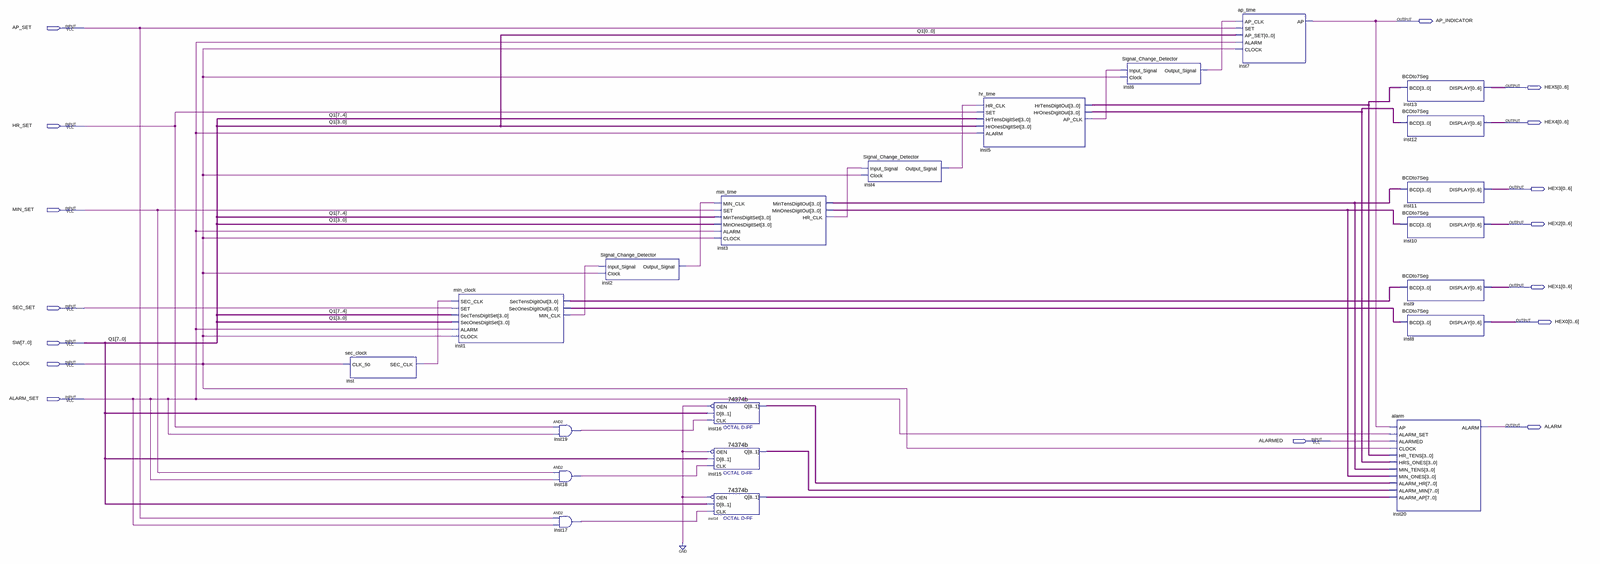
[diagram p0: schematic sheet, whole]
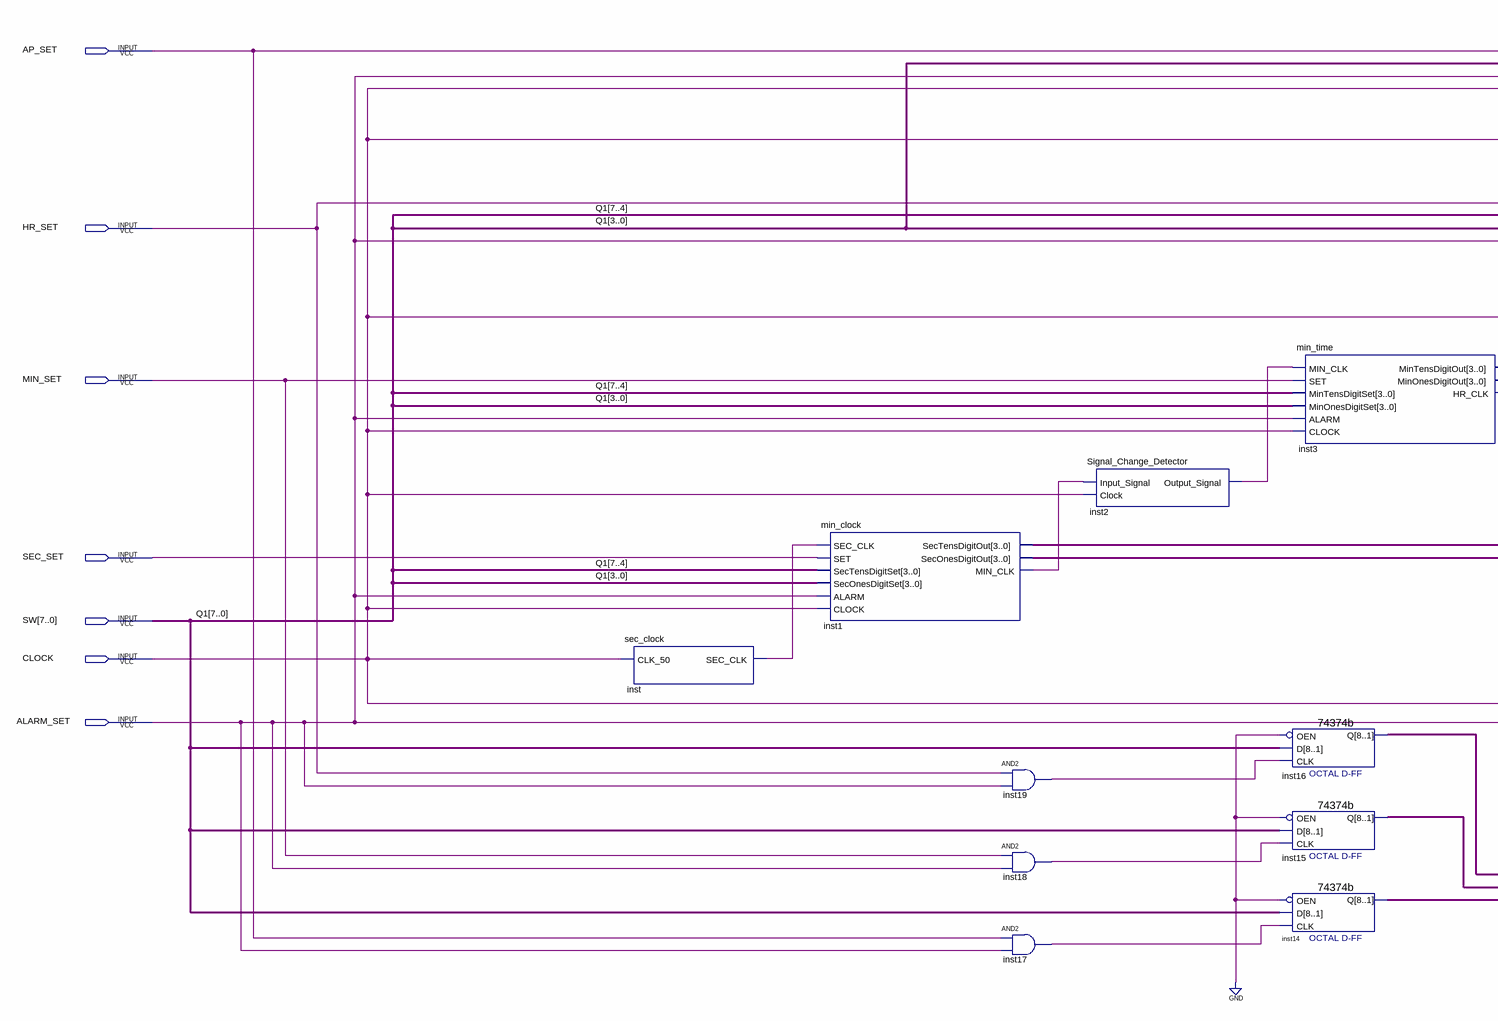
[diagram p1: schematic sheet, left part]
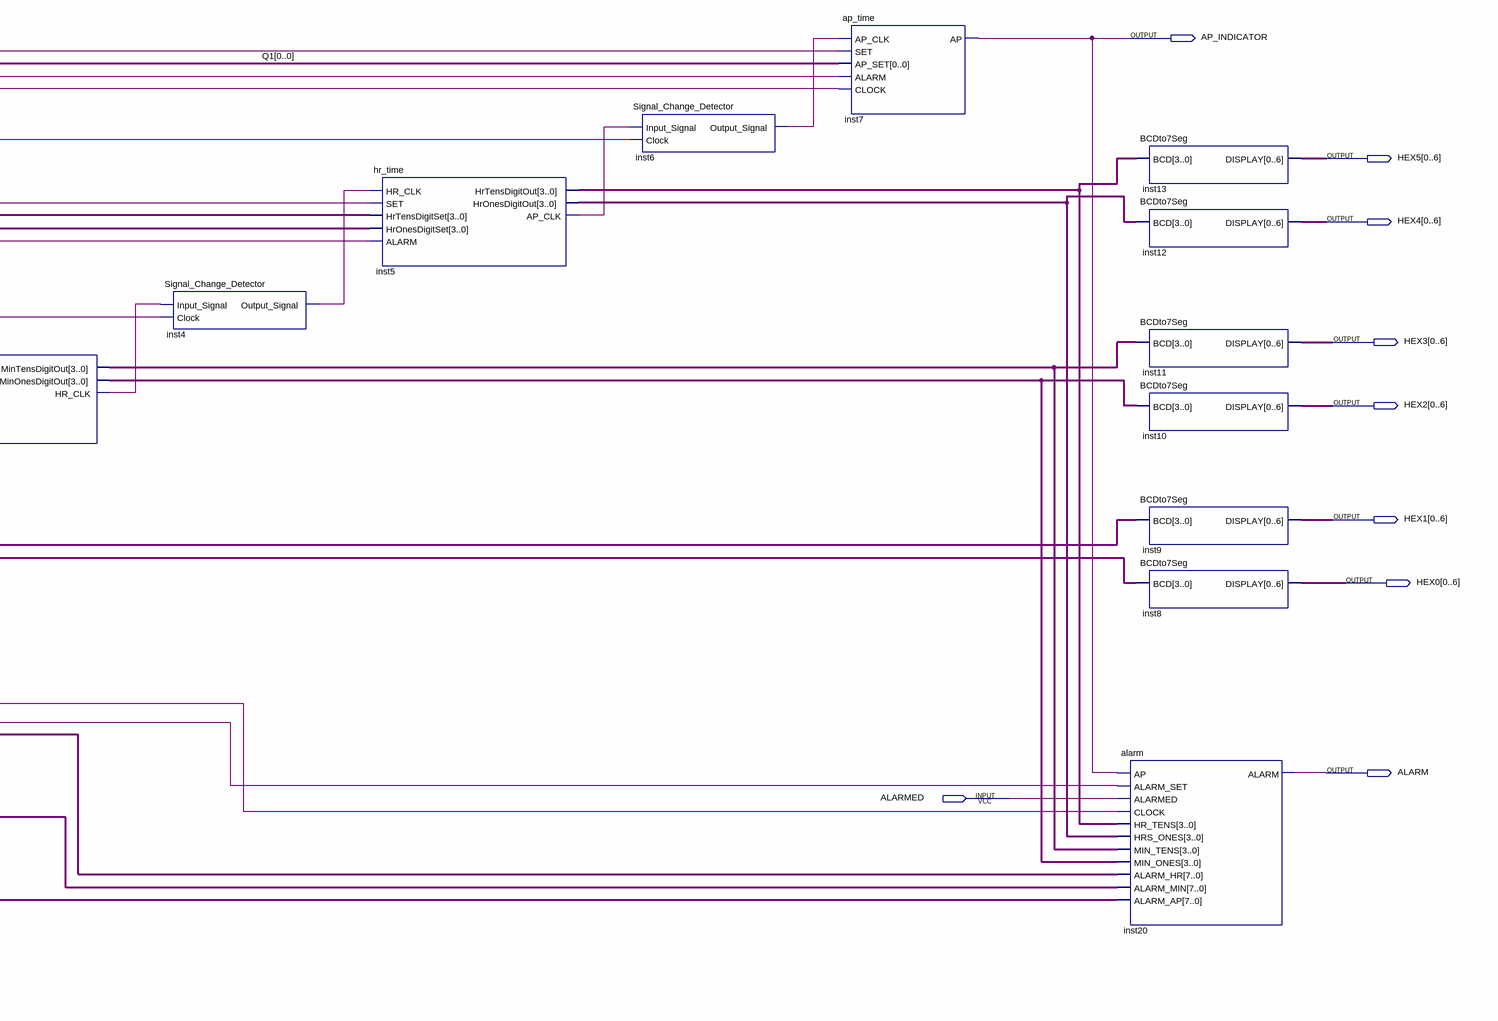
[diagram p2: schematic sheet, right part]
// Quartus schematic lab3_1.bdf as structural Verilog: 21 symbols, 16 pins
module lab3_1 (
  input  AP_SET,
  input  HR_SET,
  input  MIN_SET,
  input  SEC_SET,
  input  [7:0] SW,
  input  CLOCK,
  input  ALARM_SET,
  input  ALARMED,
  output AP_INDICATOR,
  output [0:6] HEX5,
  output [0:6] HEX4,
  output [0:6] HEX3,
  output [0:6] HEX2,
  output [0:6] HEX1,
  output [0:6] HEX0,
  output ALARM
);

  wire inst1_min_clk, inst2_output_signal, inst3_hr_clk, inst4_output_signal, inst5_ap_clk,
       inst6_output_signal, inst17_out, inst18_out, inst19_out, inst_sec_clk;
  wire [3:0] inst1_seconesdigitout, inst1_sectensdigitout, inst3_minonesdigitout, inst3_mintensdigitout,
       inst5_hronesdigitout, inst5_hrtensdigitout;
  wire [7:0] inst14_q, inst15_q, inst16_q;

  sec_clock inst (.CLK_50(CLOCK), .SEC_CLK(inst_sec_clk));
  min_clock inst1 (
    .SEC_CLK(inst_sec_clk), .SET(SEC_SET), .SecTensDigitSet(SW[7:4]), .SecOnesDigitSet(SW[3:0]),
    .ALARM(ALARM_SET), .CLOCK(CLOCK), .SecTensDigitOut(inst1_sectensdigitout),
    .SecOnesDigitOut(inst1_seconesdigitout), .MIN_CLK(inst1_min_clk));
  and inst19 (inst19_out, HR_SET, ALARM_SET);
  and inst18 (inst18_out, MIN_SET, ALARM_SET);
  and inst17 (inst17_out, AP_SET, ALARM_SET);
  Signal_Change_Detector inst2 (.Input_Signal(inst1_min_clk), .Clock(CLOCK), .Output_Signal(inst2_output_signal));
  min_time inst3 (
    .MIN_CLK(inst2_output_signal), .SET(MIN_SET), .MinTensDigitSet(SW[7:4]), .MinOnesDigitSet(SW[3:0]),
    .ALARM(ALARM_SET), .CLOCK(CLOCK), .MinTensDigitOut(inst3_mintensdigitout),
    .MinOnesDigitOut(inst3_minonesdigitout), .HR_CLK(inst3_hr_clk));
  \74374b  inst16 (.D(SW), .OEN(1'b0), .CLK(inst19_out), .Q(inst16_q));
  \74374b  inst15 (.D(SW), .OEN(1'b0), .CLK(inst18_out), .Q(inst15_q));
  \74374b  inst14 (.D(SW), .OEN(1'b0), .CLK(inst17_out), .Q(inst14_q));
  Signal_Change_Detector inst4 (.Input_Signal(inst3_hr_clk), .Clock(CLOCK), .Output_Signal(inst4_output_signal));
  hr_time inst5 (
    .HR_CLK(inst4_output_signal), .SET(HR_SET), .HrTensDigitSet(SW[7:4]), .HrOnesDigitSet(SW[3:0]),
    .ALARM(ALARM_SET), .HrTensDigitOut(inst5_hrtensdigitout), .HrOnesDigitOut(inst5_hronesdigitout),
    .AP_CLK(inst5_ap_clk));
  Signal_Change_Detector inst6 (.Input_Signal(inst5_ap_clk), .Clock(CLOCK), .Output_Signal(inst6_output_signal));
  ap_time inst7 (
    .AP_CLK(inst6_output_signal), .SET(AP_SET), .AP_SET(SW[0]), .ALARM(ALARM_SET), .CLOCK(CLOCK),
    .AP(AP_INDICATOR));
  alarm inst20 (
    .AP(AP_INDICATOR), .ALARM_SET(ALARM_SET), .ALARMED(ALARMED), .CLOCK(CLOCK),
    .HR_TENS(inst5_hrtensdigitout), .HRS_ONES(inst5_hronesdigitout), .MIN_TENS(inst3_mintensdigitout),
    .MIN_ONES(inst3_minonesdigitout), .ALARM_HR(inst16_q), .ALARM_MIN(inst15_q), .ALARM_AP(inst14_q),
    .ALARM(ALARM));
  BCDto7Seg inst13 (.BCD(inst5_hrtensdigitout), .DISPLAY(HEX5));
  BCDto7Seg inst12 (.BCD(inst5_hronesdigitout), .DISPLAY(HEX4));
  BCDto7Seg inst11 (.BCD(inst3_mintensdigitout), .DISPLAY(HEX3));
  BCDto7Seg inst10 (.BCD(inst3_minonesdigitout), .DISPLAY(HEX2));
  BCDto7Seg inst9 (.BCD(inst1_sectensdigitout), .DISPLAY(HEX1));
  BCDto7Seg inst8 (.BCD(inst1_seconesdigitout), .DISPLAY(HEX0));

  // Other names for the same wires on the sheet: Q1[7:0] = SW
endmodule
